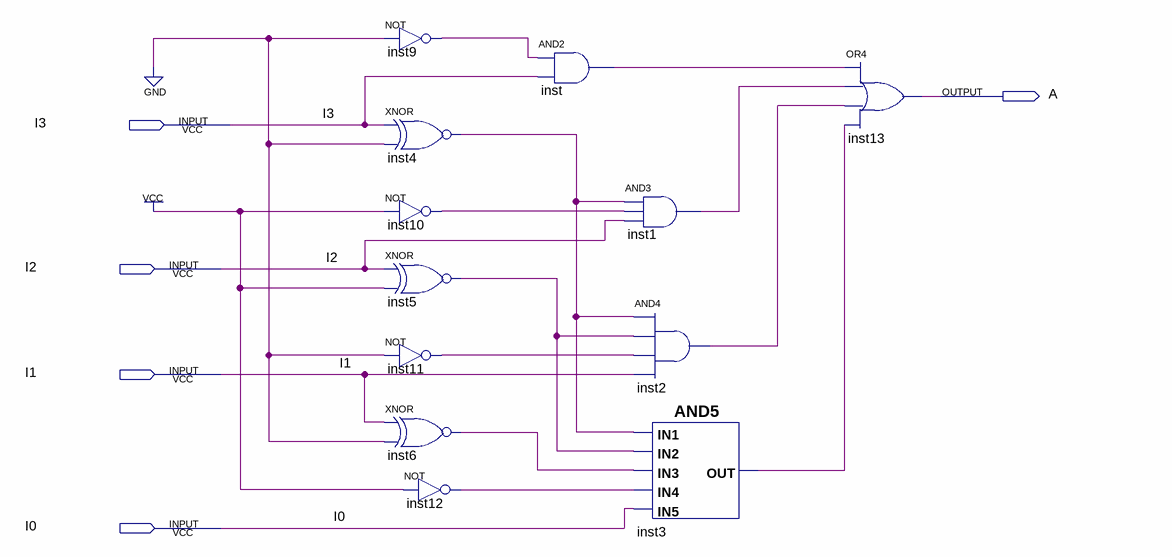
[diagram p0: schematic sheet]
// Quartus schematic Comparator4.bdf as structural Verilog: 12 symbols, 5 pins
module Comparator4 (
  input  I3,
  input  I2,
  input  I1,
  input  I0,
  output A
);

  wire inst1_out, inst2_out, inst3_out, inst4_out, inst5_out, inst6_out, inst9_out, inst10_out, inst11_out,
       inst12_out, inst_out;

  not inst9 (inst9_out, 1'b0);
  xnor inst4 (inst4_out, I3, 1'b0);
  not inst10 (inst10_out, 1'b1);
  xnor inst5 (inst5_out, I2, 1'b1);
  not inst11 (inst11_out, 1'b0);
  xnor inst6 (inst6_out, I1, 1'b0);
  not inst12 (inst12_out, 1'b1);
  and inst (inst_out, inst9_out, I3);
  and inst1 (inst1_out, inst4_out, inst10_out, I2);
  and inst2 (inst2_out, inst4_out, inst5_out, inst11_out, I1);
  and inst3 (inst3_out, inst4_out, inst5_out, inst6_out, inst12_out, I0);
  or inst13 (A, inst_out, inst1_out, inst2_out, inst3_out);
endmodule
